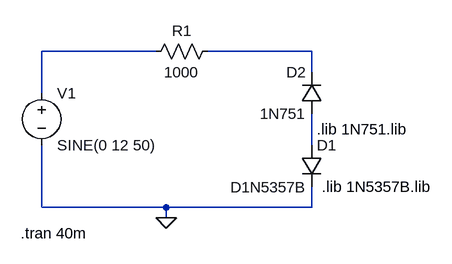
[diagram p0: schematic simulacion3-1.asc]
simulacion3-1.asc, the LTspice schematic file:
Version 4.1
SHEET 1 880 680
WIRE 192 64 16 64
WIRE 432 64 272 64
WIRE 432 96 432 64
WIRE 16 128 16 64
WIRE 432 208 432 160
WIRE 16 304 16 208
WIRE 208 304 16 304
WIRE 432 304 432 272
WIRE 432 304 208 304
WIRE 208 320 208 304
FLAG 208 320 0
SYMBOL voltage 16 112 R0
WINDOW 123 0 0 Left 0
WINDOW 39 0 0 Left 0
SYMATTR InstName V1
SYMATTR Value SINE(0 12 50)
SYMBOL res 288 48 R90
WINDOW 0 0 56 VBottom 2
WINDOW 3 32 56 VTop 2
SYMATTR InstName R1
SYMATTR Value 1000
SYMBOL diode 416 208 R0
WINDOW 3 -109 65 Left 2
SYMATTR InstName D1
SYMATTR Value D1N5357B
SYMBOL diode 448 160 R180
WINDOW 0 24 64 Left 2
WINDOW 3 24 0 Left 2
SYMATTR InstName D2
SYMATTR Value 1N751
TEXT 448 272 Left 2 !.lib 1N5357B.lib
TEXT 440 184 Left 2 !.lib 1N751.lib
TEXT -16 344 Left 2 !.tran 40m

The netlist it stands for:
* simulacion3-1.asc
V1 N001 0 SINE(0 12 50)
R1 N002 N001 1000
D1 N003 0 D1N5357B
D2 N003 N002 1N751
.model D D
.lib standard.dio
.lib 1N5357B.lib
.lib 1N751.lib
.tran 40m
.backanno
.end